# EAGLE design atmospheric-1b1 (EAGLE 9.6.2)
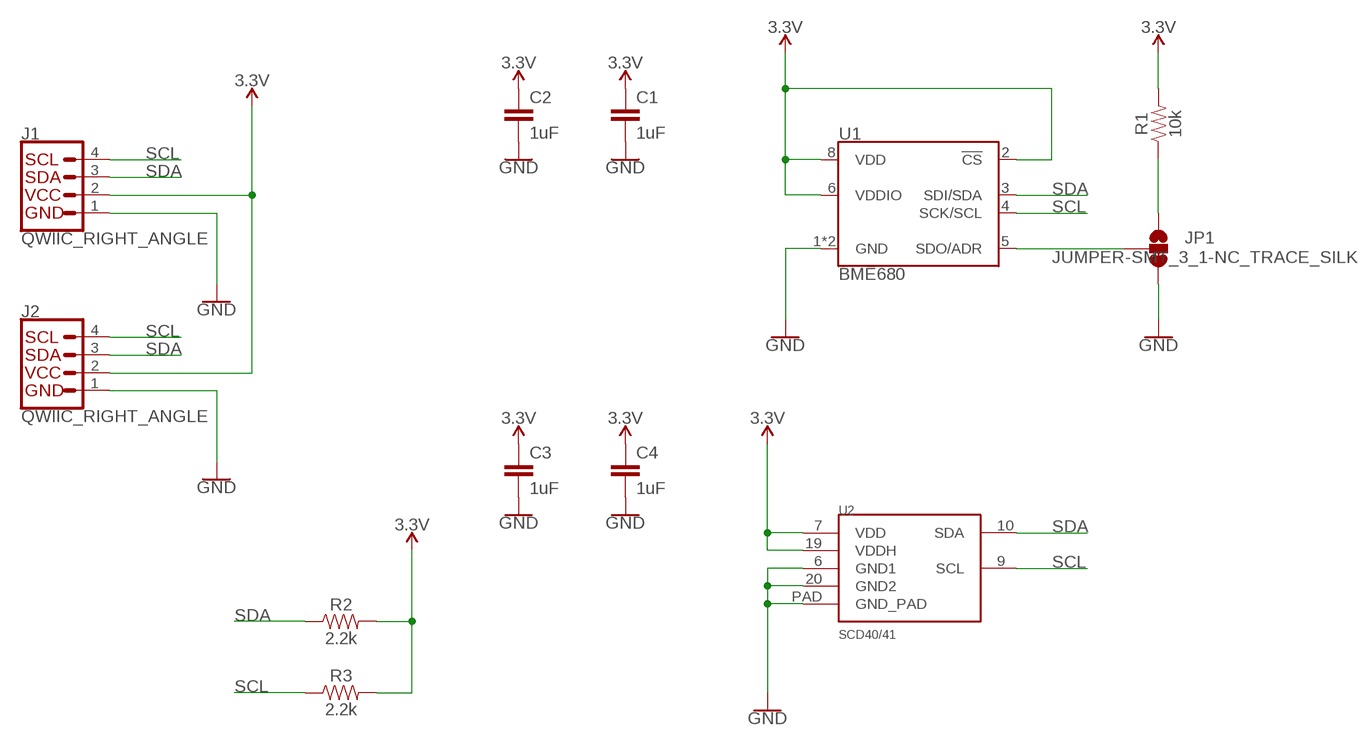
[diagram p0: schematic, sheet 1]

## Parts
C1  1uF  CAP-0603  [0603]
C2  1uF  CAP-0603  [0603]
C3  1uF  CAP-0603  [0603]
C4  1uF  CAP-0603  [0603]
J1  QWIIC_RIGHT_ANGLE  QWIIC_CONNECTORJS-1MM  [JST04_1MM_RA]
J2  QWIIC_RIGHT_ANGLE  QWIIC_CONNECTORJS-1MM  [JST04_1MM_RA]
JP1  JUMPER-SMT_3_1-NC_TRACE_SILK  [SMT-JUMPER_3_1-NC_TRACE_SILK]
R1  10k  RESISTOR0603  [0603]
R2  2.2k  RESISTOR0603  [0603]
R3  2.2k  RESISTOR0603  [0603]
U1  BME680  BME680-LGA  [LGA3.0X3.0]
U2  SCD4X  [SCD4X]

## Nets
3.3V: C1.1 C2.1 C3.1 C4.1 J1.2 J2.2 R1.2 R2.2 R3.2 U1.2(!CS) U1.6(VDDIO) U1.8(VDD) U2.7(VDD) U2.19(VDDH)
GND: C1.2 C2.2 C3.2 C4.2 J1.1 J2.1 JP1.3 U1.1(GND) U1.7(GND) U2.6(GND1) U2.20(GND2) U2.PAD(GND_PAD)
N$1: JP1.2 U1.5(SDO/ADR)
N$2: JP1.1 R1.1
SCL: J1.4 J2.4 R3.1 U1.4(SCK/SCL) U2.9(SCL)
SDA: J1.3 J2.3 R2.1 U1.3(SDI/SDA) U2.10(SDA)

## Library data of the parts
C1-C4 = SparkFun-Capacitors:CAP
J1 J2 = SparkFun-Connectors:QWIIC_CONNECTOR: SparkFun I2C Standard Qwiic Connector An SMD 1mm pitch JST connector makes it easy and quick (get it? Qwiic?) to connect I2C devices to each other. The Qwiic system <http://www.sparkfun.com/qwiic> enables fast and solderless connection between popular platforms and various sensors and actuators. We carry 200mm <https://www.sparkfun.com/products/14204>, 100mm <https://www.sparkfun.com/products/14205>, 50mm <https://www.sparkfun.com/products/14206>, and breadboard friendly <https://www.sparkfun.com/products/14207> Qwiic cables. We also offer 10 pcs strips <https://www.sparkfun.com/products/14323> the SMD connectors.; PROD_ID: CONN-13694
JP1 = SparkFun-Jumpers:JUMPER-SMT_3_1-NC_TRACE: Normally closed trace jumper (1 of 2 connections) This jumper has a trace between two pads so it's normally closed (NC). The other connection is normally open (NO). Use a razor knife to open the connection. For best results follow the IPC guidelines for cutting traces: Cutout at least 0.063 mm (0.005 in). Remove all loose material to clean up the cut area. Seal the cut with an approved epoxy. Reapply solder to reclose the connection, or to close the NO connection.
R1-R3 = SparkFun-Resistors:RESISTOR: Generic Resistor Package
U1 = SparkFun-Sensors:BME680: Bosch BME680 – Combined Humidity and Pressure Sensor The BME680 is as combined digital humidity, pressure and temperature sensor based on proven sensing principles. The sensor module is housed in an extremely compact metal-lid LGA package with a footprint of only 3.0×3.0mm with a height of 0.93mm. Its small dimensions and its low power consumption allow the implementation in battery driven devices such as handsets, GPS modules or watches.; PROD_ID: IC-14656
U2 = notes1a:SCD4X

## Board
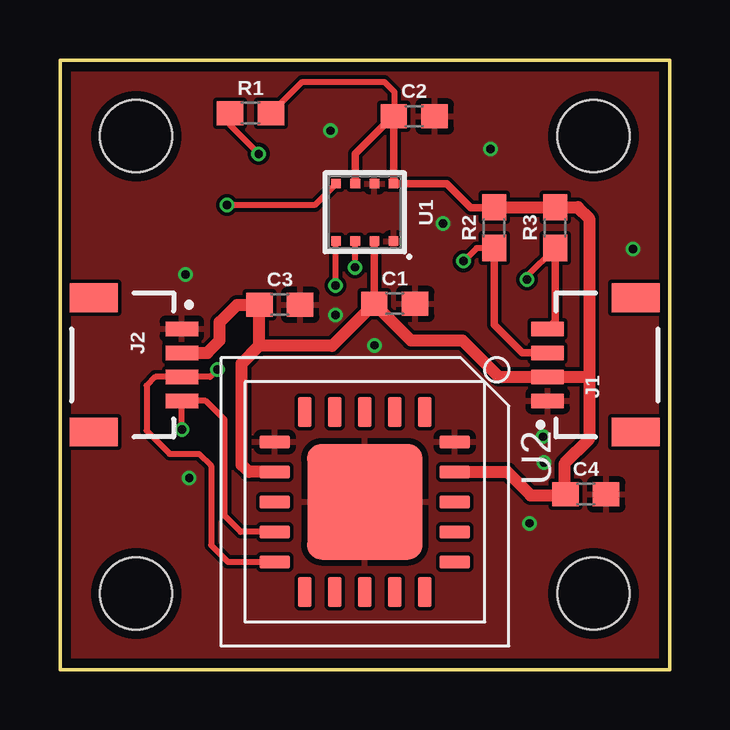
[diagram p1: board, top side]
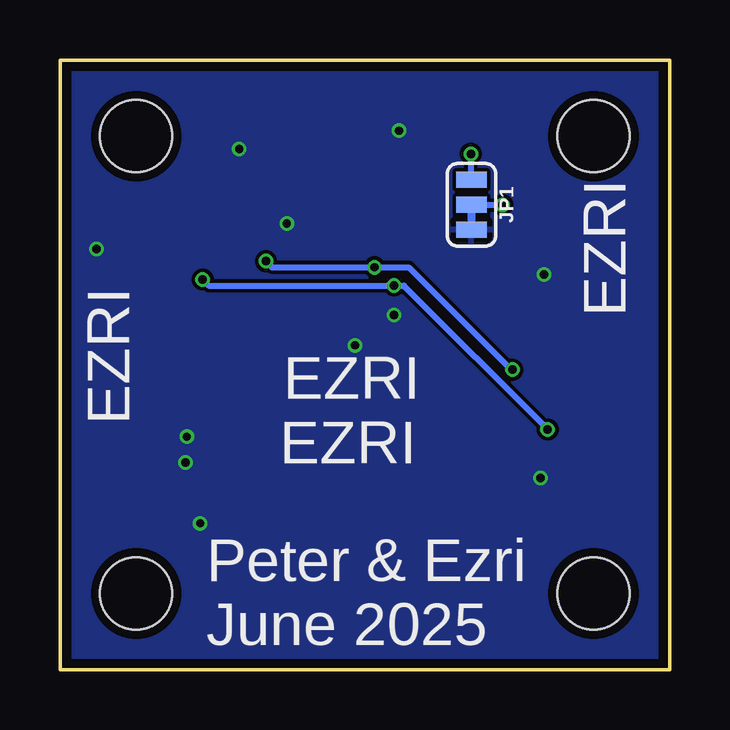
[diagram p2: board, bottom side, seen from below]

Size 25.4 x 25.4 mm. Coordinates in mm from the lower left corner, seen from the top.
Outline: 0,0 0,25.4 25.4,25.4 25.4,0 0,0
Copper layers (1*16): Top 0.035559375mm / dielectric 1.6mm / Bottom 0.035559375mm
Design rules "oshpark-2layer": minimum track width 6mil, minimum drill 10mil, track to track 6mil, track to pad 6mil, pad to pad 6mil, via to via 6mil, smd to smd 6mil, copper to edge 15mil, drill to drill 6mil, minimum pad ring 5mil, minimum via ring 5mil, stop-mask expansion 2.5mil, vias tented up to drill 0mil, thermal gap 10mil
Holes 3 mm at 3.17,22.23 22.23,22.23 22.23,3.17 3.17,3.17

### Footprints (pad centres in the part's own frame; a part is rotated, then mirrored left to right if it is on the bottom)
0603 = smd 1.1 x 1: 1 -0.85,0; 2 0.85,0
JST04_1MM_RA = smd 0.6 x 1.35: 1 -1.5,0; 2 -0.5,0; 3 0.5,0; 4 1.5,0 | smd 1.2 x 2: NC1 2.8,-3.675; NC2 -2.8,-3.675
SMT-JUMPER_3_1-NC_TRACE_SILK = smd 0.66 x 1.27: 1 -1.041,0; 2 0,0; 3 1.041,0
LGA3.0X3.0 = smd 0.4 x 0.4: 1 1.2,1.2; 2 1.2,0.4; 3 1.2,-0.4; 4 1.2,-1.2; 5 -1.2,-1.2; 6 -1.2,-0.4; 7 -1.2,0.4; 8 -1.2,1.2
SCD4X = smd 1.25 x 0.55: 1 -3.75,2.5; 2 -3.75,1.25; 3 -3.75,0; 4 -3.75,-1.25; 5 -3.75,-2.5; 11 3.75,-2.5; 12 3.75,-1.25; 13 3.75,0; 14 3.75,1.25; 15 3.75,2.5 | smd 0.55 x 1.25: 6 -2.5,-3.75; 7 -1.25,-3.75; 8 0,-3.75; 9 1.25,-3.75; 10 2.5,-3.75; 16 2.5,3.75; 17 1.25,3.75; 18 0,3.75; 19 -1.25,3.75; 20 -2.5,3.75 | smd 4.8 x 4.8: PAD 0,0

### Placement (x,y rotation side)
C1  13.94,15.24 0 top
C2  14.76,23.05 0 top
C3  9.16,15.2 0 top
C4  21.91,7.3 0 top
J1  20.32,12.7 90 top
J2  5.08,12.7 270 top
JP1  8.26,19.37 270 bottom
R1  7.94,23.18 0 top
R2  18.1,18.41 90 top
R3  20.64,18.41 90 top
U1  12.7,19.05 270 top
U2  12.7,6.99 270 top

### Tracks (layer width: path | path; a pad name or v marks a point on that pad's centre or on a via)
3.3V
  Top 0.254: C2.1 13.9,23.1 13.93,23.13 13.93,24.07 13.51,24.49 10.1,24.49 R1.2 | 18.09,19.25 R2.2 | 12.3,21.38 12.29,21.39 12.29,21.49 | C1.1
  Top 0.305: 18.09,19.25 17.12,19.25 16.12,20.25 U1.8 13.9,23.1 12.29,21.49 | U1.6 12.3,21.38 | U1.2 C1.1 | 21.02,7.26 C4.1
  Top 0.406: 22.04,12.2 22.05,12.19 | J1.2 | 13.08,15.23 C1.1
  Top 0.508: R2.2 R3.2 21.58,19.27 22.05,18.8 22.05,12.19 22.05,9.6 21.02,8.57 21.02,7.26 19.61,7.26 18.64,8.23 U2.19 | J1.2 22.04,12.2 | U2.7 7.87,8.23 7.57,8.53 7.57,12.75 8.31,13.49 | J1.2 18.29,12.19 16.76,13.72 14.62,13.72 C1.1 11.34,13.49 8.31,13.49 | 8.31,13.49 C3.1 7.38,15.2 6.66,14.48 6.66,13.72 6.14,13.2 J2.2
GND  (via drill 0.35)
  other vias: 13.11,13.51 11.48,14.78 20.12,9.7 19.56,6.1 5.23,16.46 5.38,7.98 20.17,8.64 23.88,17.53 17.93,21.69 15.95,18.59 11.28,22.45
  pour Top: 0,25.4 0,0 25.4,0 25.4,25.4
  pour Bottom: 0,25.4 0,0 25.4,0 25.4,25.4
N$1  (via drill 0.35)
  Top 0.254: U1.5 10.61,19.36 v6.96,19.36
  Bottom 0.254: v6.96,19.36 8.24,19.36 JP1.2
N$2  (via drill 0.35)
  Top 0.254: R1.1 7.09,22.68 v8.28,21.49
  Bottom 0.254: v8.28,21.49 8.28,20.43 JP1.1
SCL  (via drill 0.35)
  Top 0.254: U2.9 7.52,5.74 6.86,6.4 6.86,10.41 6.07,11.2 J2.4 v5.08,10.01 | R3.1 19.46,16.38 v19.46,16.26 | v11.48,16 11.48,17.83 U1.4
  Top 0.305: J1.4 20.64,14.52 R3.1
  Bottom 0.254: v19.46,16.26 19.2,16 v11.48,16 11.07,16 v5.08,10.01
SDA  (via drill 0.35)
  Top 0.254: U2.10 7,4.49 6.3,5.18 6.3,8.48 5.79,8.99 4.57,8.99 3.61,9.96 3.61,11.84 3.97,12.2 J2.3 6.26,12.2 v6.55,12.5 | R2.1 17.36,17.57 v16.82,17.02 | v12.29,16.76 U1.3
  Top 0.305: J1.3 19.26,13.2 18.09,14.38 18.09,17.55 R2.1
  Bottom 0.254: v16.82,17.02 16.56,16.76 v12.29,16.76 10.87,16.76 6.6,12.5 v6.55,12.5

### Text on the board
bPlace: EZRI | EZRI | EZRI | EZRI | Peter & Ezri / June 2025